# Altium project ADSR Envelope Generator.PrjPcb
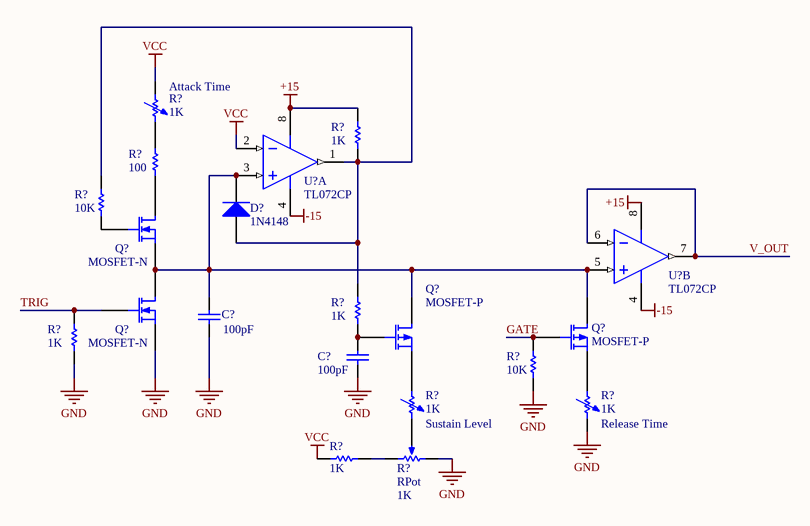
[diagram p0: ADSR Envelope Generator.SchDoc]
1 sheet, 20 parts. Net scope: global (net labels, ports and power ports of the same name join across sheets).
Board file: ADSR Envelope Generator.PcbDoc

## Sheet ADSR Envelope Generator.SchDoc: ADSR Envelope Generator
size Letter; Organization: Altium Limited; Address1: L3, 12a Rodborough Rd; Address2: Frenchs Forest; Address3: NSW; Address4: Australia 2086

### Parts
(Parts that share a designator on the sheet are numbered #1, #2 ... from top to bottom, then left to right.)
C?#1  value 100pF  [RAD-0.3]  (hidden comment: Cap)
C?#2  value 100pF  [RAD-0.3]  (hidden comment: Cap)
D?  1N4148  [DO-35]
Q?#1  MOSFET-N  [E3]
Q?#2  MOSFET-N  [E3]
Q?#3  MOSFET-P  [E3]
Q?#4  MOSFET-P  [E3]
R?#1  Attack Time  value 1K  [AXIAL-0.7]
R?#2  value 1K  [AXIAL-0.5]  (hidden comment: Res Semi)
R?#3  value 100  [AXIAL-0.5]  (hidden comment: Res Semi)
R?#4  value 10K  [AXIAL-0.5]  (hidden comment: Res Semi)
R?#5  value 1K  [AXIAL-0.5]  (hidden comment: Res Semi)
R?#6  value 1K  [AXIAL-0.5]  (hidden comment: Res Semi)
R?#7  value 10K  [AXIAL-0.5]  (hidden comment: Res Semi)
R?#8  Sustain Level  value 1K  [AXIAL-0.7]
R?#9  Release Time  value 1K  [AXIAL-0.7]
R?#10  RPot  value 1K  [VR5]
R?#11  value 1K  [AXIAL-0.5]  (hidden comment: Res Semi)
U?#1  TL072CP  [TI-P8]  (part A of 2)
U?#2  TL072CP  [TI-P8]  (part B of 2)

### Nets
+15: R?#2.2 U?#1.8(VCC+) U?#2.8(VCC+)
-15: U?#1.4(VCC-) U?#2.4(VCC-)
GND: C?#1.1 C?#2.1 Q?#2.3(S) R?#6.1 R?#7.1 R?#9.2 R?#10.1(TOP)
VCC: R?#1.1 R?#11.2 U?#1.2(IN1-)
GATE: Q?#4.2(G) R?#7.2
TRIG: Q?#2.2(G) R?#6.2
V_OUT: U?#2.6(IN2-) U?#2.7(OUT2)
NetC?#1_2: C?#1.2 D?.2(K) Q?#1.3(S) Q?#2.1(D) Q?#3.1(D) Q?#4.1(D) U?#1.3(IN1+) U?#2.5(IN2+)
NetC?#2_2: C?#2.2 Q?#3.2(G) R?#5.1
NetD?_1: D?.1(A) R?#2.1 R?#4.2 R?#5.2 U?#1.1(OUT1)
NetQ?#1_1: Q?#1.1(D) R?#3.1
NetQ?#1_2: Q?#1.2(G) R?#4.1
NetQ?#3_3: Q?#3.3(S) R?#8.1
NetQ?#4_3: Q?#4.3(S) R?#9.1
NetR?#1_2: R?#1.2 R?#3.2
NetR?#8_2: R?#8.2 R?#10.3(TAP)
NetR?#10_2: R?#10.2(BOT) R?#11.1

### Notes on the sheet
- Title
- Size:
- Date:
- Letter
- Number:
- Time:
- Revision:
- Sheet
- of
- File:

### Library data of the parts
C?#1 C?#2 = Cap: Capacitor; Published: 8-Jun-2000; LatestRevisionDate: 17-Jul-2002; LatestRevisionNote: Re-released for DXP Platform.; PackageReference: RAD-0.3; Publisher: Altium Limited; PackageDescription: Radial Cap, Thru-Hole; 2 Leads; 0.3 in Pin Spacing
D? = Diode 1N4148: High Conductance Fast Diode; Published: 8-Jun-2000; LatestRevisionDate: 17-Jul-2002; LatestRevisionNote: Re-released for DXP Platform.; DatasheetVersion: 1997; PackageReference: DO-35; Publisher: Altium Limited; PackageDescription: Diode, Axial; Body 3.8 x 1.9 mm (LxDia. max), Lead Dia. 0.53 mm (max); Code_JEDEC: DO-204-AH; ComponentLink1Description: Manufacturer Link; ComponentLink1URL: http://www.fairchildsemi.com/; ComponentLink2Description: Datasheet; ComponentLink2URL: http://www.fairchildsemi.com/ds/1N%2F1N4148.pdf
Q?#1 Q?#2 = MOSFET-N: N-Channel MOSFET; Published: 8-Jun-2000; LatestRevisionDate: 17-Jul-2002; LatestRevisionNote: Re-released for DXP Platform.; PackageVersion: 1995/1996; PackageReference: E3; Publisher: Altium Limited; PackageDescription: TO, Flat Index; 3 In-Line, Axial Leads; Body Dia. 4.6mm; Lead Dia. 0.5 mm (max)
Q?#3 Q?#4 = MOSFET-P: P-Channel MOSFET; Published: 8-Jun-2000; LatestRevisionDate: 17-Jul-2002; LatestRevisionNote: Re-released for DXP Platform.; PackageVersion: 1995/1996; PackageReference: E3; Publisher: Altium Limited; PackageDescription: TO, Flat Index; 3 In-Line, Axial Leads; Body Dia. 4.6mm; Lead Dia. 0.5 mm (max)
R?#1 R?#8 R?#9 = Res Adj1: Variable Resistor; Set Position: 0.5; Published: 8-Jun-2000; LatestRevisionDate: 17-Jul-2002; LatestRevisionNote: Re-released for DXP Platform.; PackageReference: AXIAL-0.7; Publisher: Altium Limited; PackageDescription: Axial Device, Thru-Hole; 2 Leads; 0.7 in Pin Spacing
R?#2-R?#7 R?#11 = Res Semi: Semiconductor Resistor; Published: 8-Jun-2000; LatestRevisionDate: 17-Jul-2002; LatestRevisionNote: Re-released for DXP Platform.; PackageReference: AXIAL-0.5; Publisher: Altium Limited; PackageDescription: Axial Device, Thru-Hole; 2 Leads; 0.5 in Pin Spacing
R?#10 = RPot: Potentiometer; Sim Note: Enter the Resistance value and the set point into parameter fields.; Set Position: 0.5; Published: 8-Jun-2000; LatestRevisionDate: 17-Jul-2002; LatestRevisionNote: Re-released for DXP Platform.; PackageReference: VR5; Publisher: Altium Limited; PackageDescription: Variable Resistor, Thru-Hole; 3 Leads
U?#1 U?#2 = TL072CP: Dual Low-Noise JFET-Input General-Purpose Operational Amplifier, 7 to 36 V, 0 to 70 degC, 8-pin DIP (P8), Pb-Free (RoHS); Manufacturer: Texas Instruments; CMRR(Min)(dB): 70; GBW(Typ)(MHz): 3; IIB(Max)(pA): 200; Iq per channel(Max)(mA): 2.5; Number of Channels: 2; Offset Drift(Typ)(uV/C): 18; Rating: Catalog; Slew Rate(Typ)(V/us): 13; Sub Family: General Purpose Amplifier, High Supply Voltage Amplifier (>=30V); Total Supply Voltage(Max)(+5V is 5, +/-5V is 10): 36; Total Supply Voltage(Min)(+5V is 5, +/-5V is 10): 7; Vio (25C)(Max)(mV): 10; DatasheetVersion: SLOS080J; PackageVersion: 4040082/E, 04/2010; PackageReference: P8; PackageDescription: 8-Pin Plastic In-Line, Body 9.59 x 6.35 mm, Pitch 2.54 mm; Supplier 1: Digi-Key; Supplier Part Number 1: 296-1775-5-ND; Supplier 2: Farnell; Supplier Part Number 2: 1106015; Supplier 3: Newark; Supplier Part Number 3: 60K6988; Supplier 4: Mouser; Supplier Part Number 4: 595-TL072CP; Eco-Plan: Pb-Free (RoHS); Vn at 1kHz(Typ)(nV/rtHz): 18; Mounting Technology: Through Hole; Code_JEDEC: MS-001; PartNumber: TL072CP; ComponentLink1Description: Manufacturer URL; ComponentLink1URL: http://www.ti.com/; ComponentLink2Description: Datasheet; ComponentLink2URL: http://www.ti.com/lit/ds/symlink/tl072.pdf; ComponentLink3Description: Package Specification; ComponentLink3URL: http://www.ti.com/litv/pdf/mpdi001b